# EAGLE design ESP12_Jig (EAGLE 9.6.2)
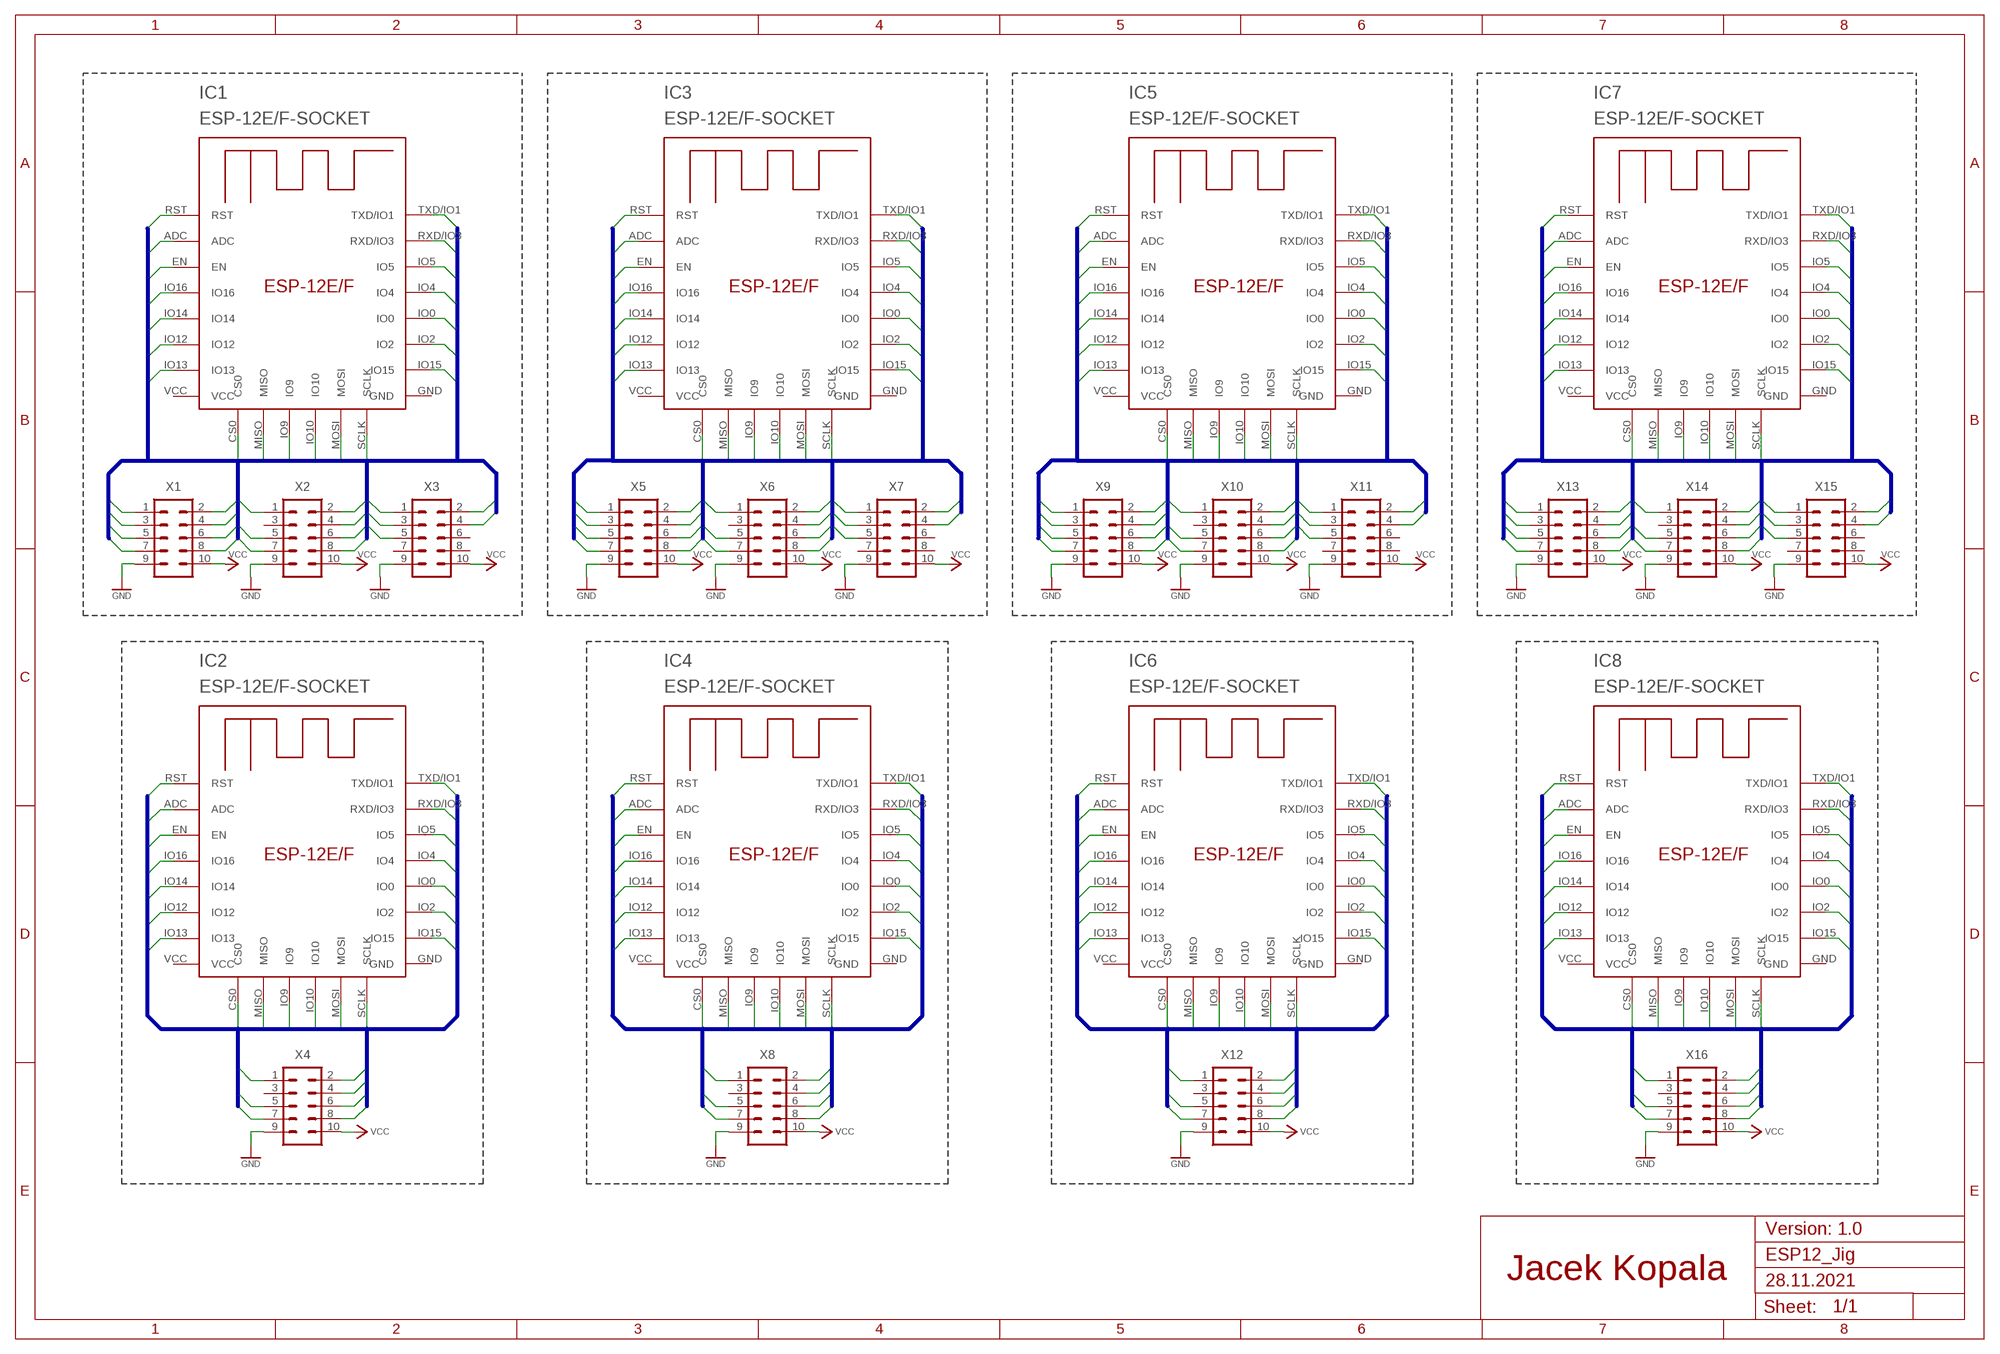
[diagram p0: schematic, sheet 1]

## Parts
IC1  ESP-12E/F-SOCKET  [ESP-12E/F-SOCKET]
IC2  ESP-12E/F-SOCKET  [ESP-12E/F-SOCKET]
IC3  ESP-12E/F-SOCKET  [ESP-12E/F-SOCKET]
IC4  ESP-12E/F-SOCKET  [ESP-12E/F-SOCKET]
IC5  ESP-12E/F-SOCKET  [ESP-12E/F-SOCKET]
IC6  ESP-12E/F-SOCKET  [ESP-12E/F-SOCKET]
IC7  ESP-12E/F-SOCKET  [ESP-12E/F-SOCKET]
IC8  ESP-12E/F-SOCKET  [ESP-12E/F-SOCKET]
X1  ML10  [ML10]
X2  ML10  [ML10]
X3  ML10  [ML10]
X4  ML10  [ML10]
X5  ML10  [ML10]
X6  ML10  [ML10]
X7  ML10  [ML10]
X8  ML10  [ML10]
X9  ML10  [ML10]
X10  ML10  [ML10]
X11  ML10  [ML10]
X12  ML10  [ML10]
X13  ML10  [ML10]
X14  ML10  [ML10]
X15  ML10  [ML10]
X16  ML10  [ML10]

## Nets
ADC_1: IC1.ADC X1.8
ADC_3: IC3.ADC X5.8
ADC_4: IC7.ADC X13.8
ADC_5: IC5.ADC X9.8
ADC_6: IC2.ADC
ADC_7: IC6.ADC
ADC_8: IC8.ADC
ADC_9: IC4.ADC
CS0_1: IC1.CS0 X1.2
CS0_3: IC3.CS0 X5.2
CS0_4: IC7.CS0 X13.2
CS0_5: IC5.CS0 X9.2
CS0_6: IC2.CS0
CS0_7: IC6.CS0
CS0_8: IC8.CS0
CS0_9: IC4.CS0
EN_1: IC1.EN X2.5
EN_3: IC3.EN X6.5
EN_4: IC7.EN X14.5
EN_5: IC5.EN X10.5
EN_6: IC2.EN X4.5
EN_7: IC6.EN X12.5
EN_8: IC8.EN X16.5
EN_9: IC4.EN X8.5
G0_1: IC1.IO0 X2.4
G0_3: IC3.IO0 X6.4
G0_4: IC7.IO0 X14.4
G0_5: IC5.IO0 X10.4
G0_6: IC2.IO0 X4.4
G0_7: IC6.IO0 X12.4
G0_8: IC8.IO0 X16.4
G0_9: IC4.IO0 X8.4
G2_1: IC1.IO2 X2.2
G2_3: IC3.IO2 X6.2
G2_4: IC7.IO2 X14.2
G2_5: IC5.IO2 X10.2
G2_6: IC2.IO2 X4.2
G2_7: IC6.IO2 X12.2
G2_8: IC8.IO2 X16.2
G2_9: IC4.IO2 X8.2
G4_1: IC1.IO4 X3.4
G4_3: IC3.IO4 X7.4
G4_4: IC7.IO4 X15.4
G4_5: IC5.IO4 X11.4
G4_6: IC2.IO4
G4_7: IC6.IO4
G4_8: IC8.IO4
G4_9: IC4.IO4
G5_1: IC1.IO5 X3.5
G5_3: IC3.IO5 X7.5
G5_4: IC7.IO5 X15.5
G5_5: IC5.IO5 X11.5
G5_6: IC2.IO5
G5_7: IC6.IO5
G5_8: IC8.IO5
G5_9: IC4.IO5
G9_1: IC1.IO9 X1.1
G9_3: IC3.IO9 X5.1
G9_4: IC7.IO9 X13.1
G9_5: IC5.IO9 X9.1
G9_6: IC2.IO9
G9_7: IC6.IO9
G9_8: IC8.IO9
G9_9: IC4.IO9
G10_1: IC1.IO10 X3.2
G10_3: IC3.IO10 X7.2
G10_4: IC7.IO10 X15.2
G10_5: IC5.IO10 X11.2
G10_6: IC2.IO10
G10_7: IC6.IO10
G10_8: IC8.IO10
G10_9: IC4.IO10
G12_1: IC1.IO12 X1.5
G12_3: IC3.IO12 X5.5
G12_4: IC7.IO12 X13.5
G12_5: IC5.IO12 X9.5
G12_6: IC2.IO12
G12_7: IC6.IO12
G12_8: IC8.IO12
G12_9: IC4.IO12
G13_1: IC1.IO13 X1.4
G13_3: IC3.IO13 X5.4
G13_4: IC7.IO13 X13.4
G13_5: IC5.IO13 X9.4
G13_6: IC2.IO13
G13_7: IC6.IO13
G13_8: IC8.IO13
G13_9: IC4.IO13
G14_1: IC1.IO14 X1.6
G14_3: IC3.IO14 X5.6
G14_4: IC7.IO14 X13.6
G14_5: IC5.IO14 X9.6
G14_6: IC2.IO14
G14_7: IC6.IO14
G14_8: IC8.IO14
G14_9: IC4.IO14
G15_1: IC1.IO15 X2.1
G15_3: IC3.IO15 X6.1
G15_4: IC7.IO15 X14.1
G15_5: IC5.IO15 X10.1
G15_6: IC2.IO15 X4.1
G15_7: IC6.IO15 X12.1
G15_8: IC8.IO15 X16.1
G15_9: IC4.IO15 X8.1
G16_1: IC1.IO16 X1.7
G16_3: IC3.IO16 X5.7
G16_4: IC7.IO16 X13.7
G16_5: IC5.IO16 X9.7
G16_6: IC2.IO16
G16_7: IC6.IO16
G16_8: IC8.IO16
G16_9: IC4.IO16
GND: X1.9 X2.9 X3.9 X4.9 X5.9 X6.9 X7.9 X8.9 X9.9 X10.9 X11.9 X12.9 X13.9 X14.9 X15.9 X16.9
MISO_1: IC1.MISO X1.3
MISO_3: IC3.MISO X5.3
MISO_4: IC7.MISO X13.3
MISO_5: IC5.MISO X9.3
MISO_6: IC2.MISO
MISO_7: IC6.MISO
MISO_8: IC8.MISO
MISO_9: IC4.MISO
MOSI_1: IC1.MOSI X3.3
MOSI_3: IC3.MOSI X7.3
MOSI_4: IC7.MOSI X15.3
MOSI_5: IC5.MOSI X11.3
MOSI_6: IC2.MOSI
MOSI_7: IC6.MOSI
MOSI_8: IC8.MOSI
MOSI_9: IC4.MOSI
RST_1: IC1.RST X2.7
RST_3: IC3.RST X6.7
RST_4: IC7.RST X14.7
RST_5: IC5.RST X10.7
RST_6: IC2.RST X4.7
RST_7: IC6.RST X12.7
RST_8: IC8.RST X16.7
RST_9: IC4.RST X8.7
RXD_1: IC1.RXD/IO3 X2.6
RXD_3: IC3.RXD/IO3 X6.6
RXD_4: IC7.RXD/IO3 X14.6
RXD_5: IC5.RXD/IO3 X10.6
RXD_6: IC2.RXD/IO3 X4.6
RXD_7: IC6.RXD/IO3 X12.6
RXD_8: IC8.RXD/IO3 X16.6
RXD_9: IC4.RXD/IO3 X8.6
SCLK_1: IC1.SCLK X3.1
SCLK_3: IC3.SCLK X7.1
SCLK_4: IC7.SCLK X15.1
SCLK_5: IC5.SCLK X11.1
SCLK_6: IC2.SCLK
SCLK_7: IC6.SCLK
SCLK_8: IC8.SCLK
SCLK_9: IC4.SCLK
TXD_1: IC1.TXD/IO1 X2.8
TXD_3: IC3.TXD/IO1 X6.8
TXD_4: IC7.TXD/IO1 X14.8
TXD_5: IC5.TXD/IO1 X10.8
TXD_6: IC2.TXD/IO1 X4.8
TXD_7: IC6.TXD/IO1 X12.8
TXD_8: IC8.TXD/IO1 X16.8
TXD_9: IC4.TXD/IO1 X8.8
VCC: X1.10 X2.10 X3.10 X4.10 X5.10 X6.10 X7.10 X8.10 X9.10 X10.10 X11.10 X12.10 X13.10 X14.10 X15.10 X16.10
Unconnected: X2.3 X3.6 X3.7 X3.8 X4.3 X6.3 X7.6 X7.7 X7.8 X8.3 X10.3 X11.6 X11.7 X11.8 X12.3 X14.3 X15.6 X15.7 X15.8 X16.3

## Buses
ADC_1,ADC_3,CS0_1,CS0_3,EN_1,EN_3,G0_1,G0_3,G2_1,G2_3,G4_1,G4_3,G5_1,G5_3,G9_1,G9_3,G10_1,G10_3,G12_1,G12_3,G13_1,G13_3,G14_1,G14_3,G15_1,G15_3,G16_1,G16_3,MISO_1,MISO_3,MOSI_1,MOSI_3,RST_1,RST_3,RXD_1,RXD_3,SCLK_1,SCLK_3,TXD_1,TXD_3
ADC_4,CS0_4,EN_4,G0_4,G2_4,G4_4,G5_4,G9_4,G10_4,G12_4,G13_4,G14_4,G15_4,G16_4,MISO_4,MOSI_4,RST_4,RXD_4,SCLK_4,TXD_4
ADC_5,CS0_5,EN_5,G0_5,G2_5,G4_5,G5_5,G9_5,G10_5,G12_5,G13_5,G14_5,G15_5,G16_5,MISO_5,MOSI_5,RST_5,RXD_5,SCLK_5,TXD_5
ADC_6,CS0_6,EN_6,G0_6,G2_6,G4_6,G5_6,G9_6,G10_6,G12_6,G13_6,G14_6,G15_6,G16_6,MISO_6,MOSI_6,RST_6,RXD_6,SCLK_6,TXD_6
ADC_7,CS0_7,EN_7,G0_7,G2_7,G4_7,G5_7,G9_7,G10_7,G12_7,G13_7,G14_7,G15_7,G16_7,MISO_7,MOSI_7,RST_7,RXD_7,SCLK_7,TXD_7
ADC_8,CS0_8,EN_8,G0_8,G2_8,G4_8,G5_8,G9_8,G10_8,G12_8,G13_8,G14_8,G15_8,G16_8,MISO_8,MOSI_8,RST_8,RXD_8,SCLK_8,TXD_8
ADC_9,CS0_9,EN_9,G0_9,G2_9,G4_9,G5_9,G9_9,G10_9,G12_9,G13_9,G14_9,G15_9,G16_9,MISO_9,MOSI_9,RST_9,RXD_9,SCLK_9,TXD_9

## Notes on the sheet
- Version: 1.0
- Jacek Kopala
- 28.11.2021

## Power pins joined to a net without a drawn wire
GND: IC1.GND IC2.GND IC3.GND IC4.GND IC5.GND IC6.GND IC7.GND IC8.GND
VCC: IC1.VCC IC2.VCC IC3.VCC IC4.VCC IC5.VCC IC6.VCC IC7.VCC IC8.VCC

## Library data of the parts
IC1-IC8 = esp-12e-f:ESP-12E/F-SOCKET
X1-X16 = con-harting-ml:ML10: HARTING; OC_FARNELL: unknown; OC_NEWARK: unknown

## Board
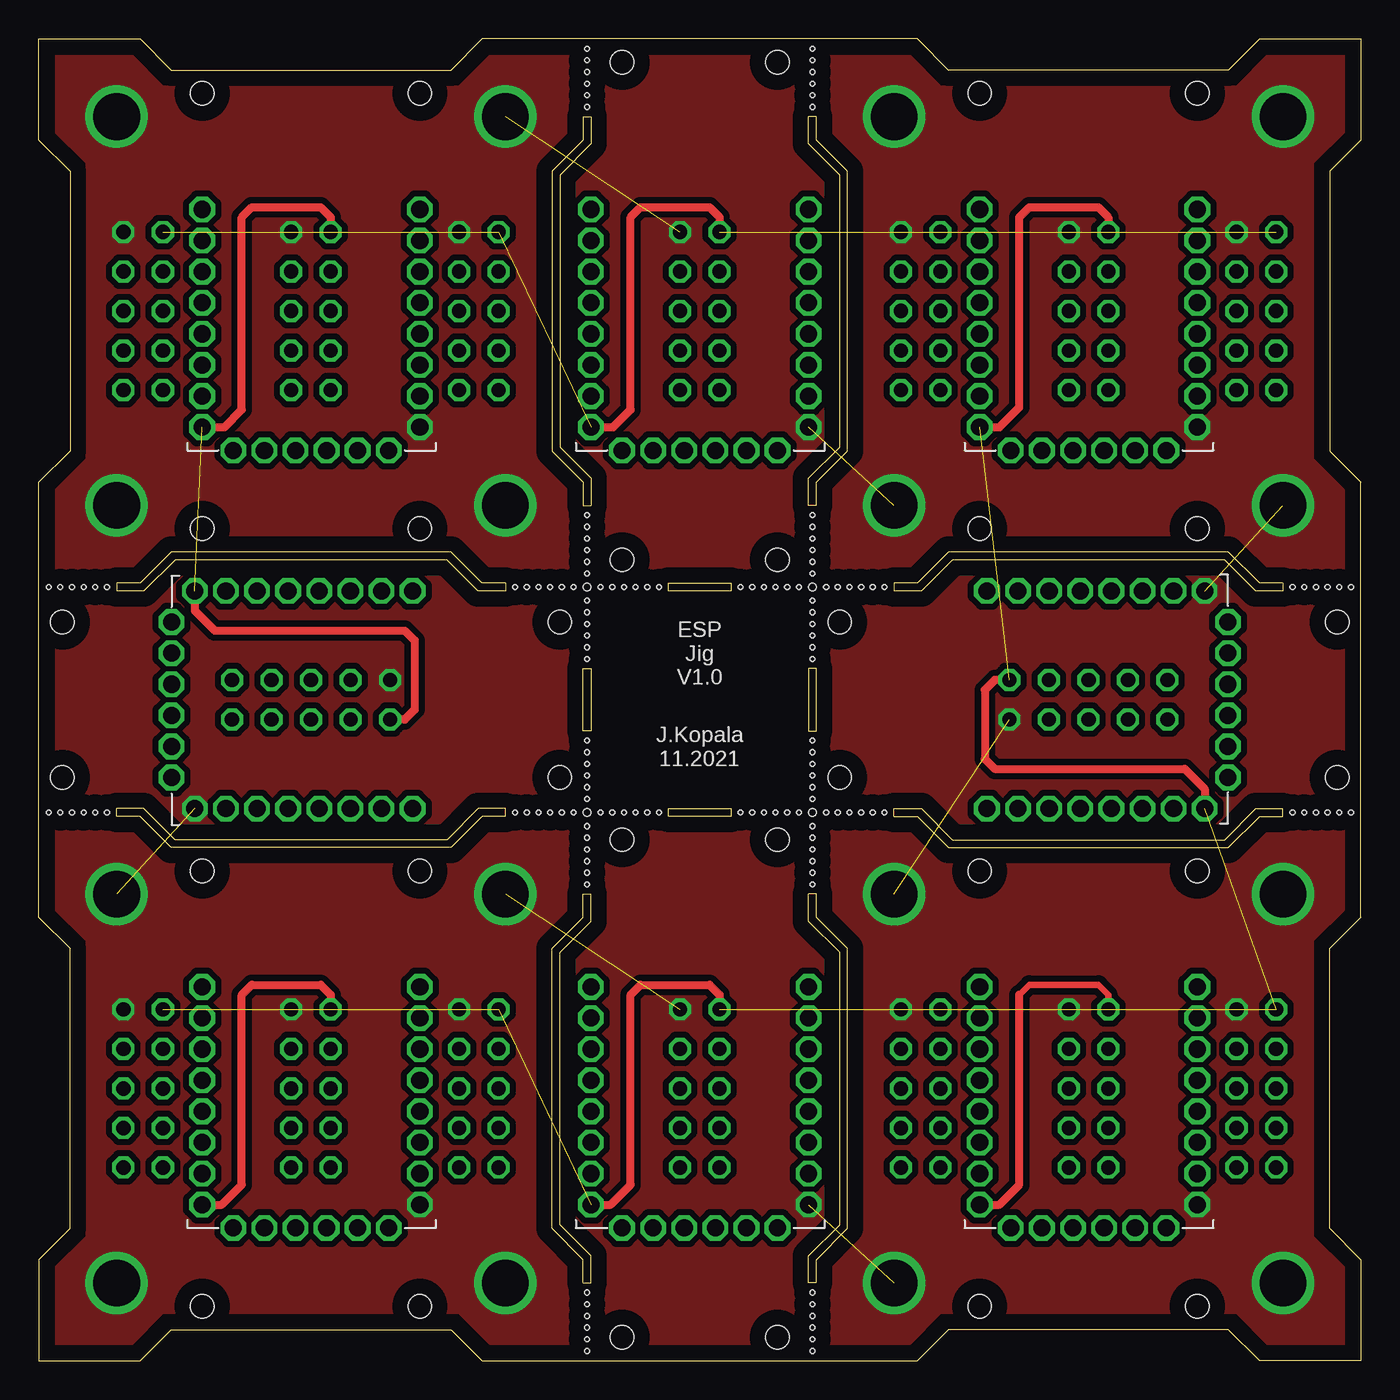
[diagram p1: board, top side]
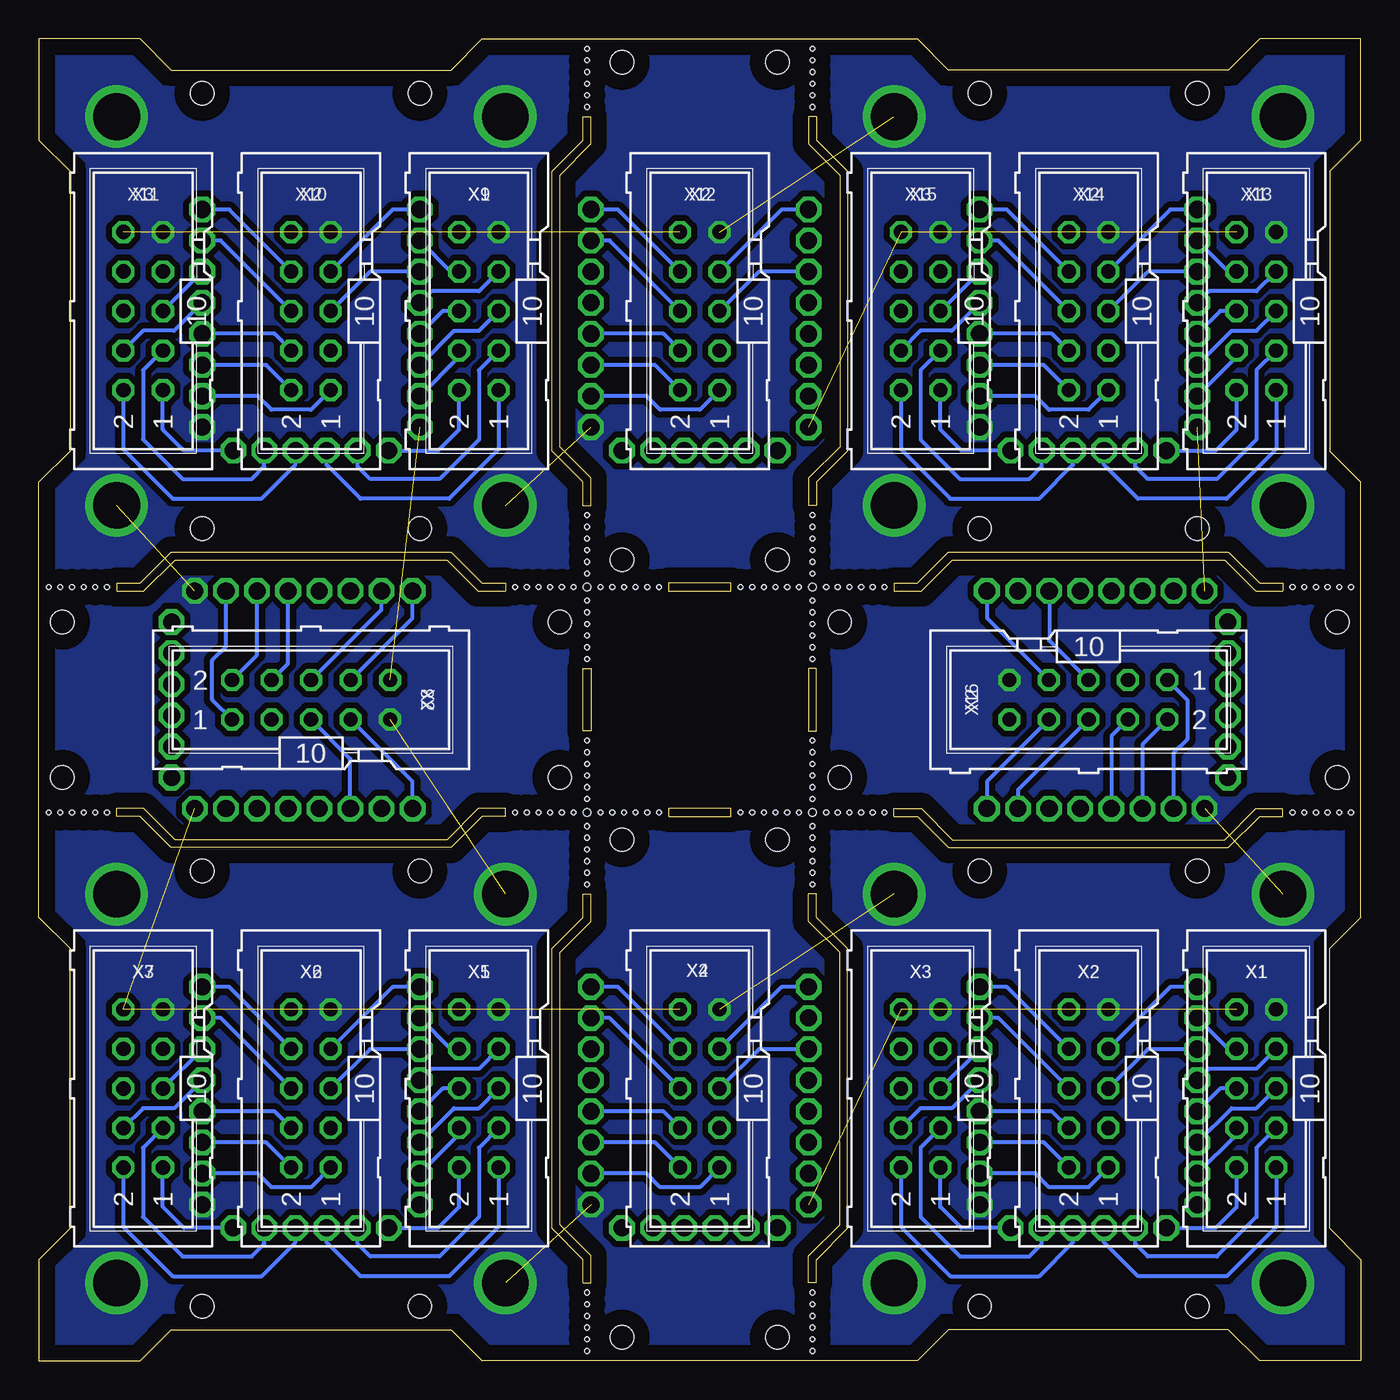
[diagram p2: board, bottom side, seen from below]

Size 85 x 85 mm. Coordinates in mm from the lower left corner, seen from the top.
Outline: 83,9.5 83,25.5
Outline: 75.5,2 59.5,2
Outline: 2,75.5 2,59.5
Outline: 9.5,83 25.5,83
Outline: 75.5,83 59.5,83
Outline: 83,75.5 83,59.5
Outline: 0,0 6.5,0 8.5,2 26.5,2 28.5,0 56.5,0 58.5,2 76.5,2 78.5,0 85,0 85,6.5 83,8.5 83,26.5 85,28.5 85,56.5 83,58.5 83,76.5 85,78.5 85,85 78.5,85 76.5,83 58.5,83 56.5,85 28.5,85 26.5,83 8.5,83 6.5,85 0,85 0,78.5 2,76.5 2,58.5 0,56.5 0,28.5 2,26.5 2,8.5 0,6.5 0,0
Outline: 35.5,5 35.5,6.75 33.5,8.75 33.5,26.25 35.5,28.25 35.5,30 35,30 35,28.5 33,26.5 33,8.5 35,6.5 35,5 35.5,5
Outline: 30,35.5 28.25,35.5 26.25,33.5 8.75,33.5 6.75,35.5 5,35.5 5,35 6.5,35 8.5,33 26.5,33 28.5,35 30,35 30,35.5
Outline: 49.5,5 49.5,6.75 51.5,8.75 51.5,26.25 49.5,28.25 49.5,30 50,30 50,28.5 52,26.5 52,8.5 50,6.5 50,5 49.5,5
Outline: 55,35.5 56.75,35.5 58.75,33.5 76.25,33.5 78.25,35.5 80,35.5 80,35 78.5,35 76.5,33 58.5,33 56.5,35 55,35 55,35.5
Outline: 35.5,80 35.5,78.25 33.5,76.25 33.5,58.75 35.5,56.75 35.5,55 35,55 35,56.5 33,58.5 33,76.5 35,78.5 35,80 35.5,80
Outline: 30,49.5 28.25,49.5 26.25,51.5 8.75,51.5 6.75,49.5 5,49.5 5,50 6.5,50 8.5,52 26.5,52 28.5,50 30,50 30,49.5
Outline: 80,49.5 78.25,49.5 76.25,51.5 58.75,51.5 56.75,49.5 55,49.5 55,50 56.5,50 58.5,52 76.5,52 78.5,50 80,50 80,49.5
Outline: 49.5,55 49.5,56.75 51.5,58.75 51.5,76.25 49.5,78.25 49.5,80 50,80 50,78.5 52,76.5 52,58.5 50,56.5 50,55 49.5,55
Outline: 35.5,40.5 35,40.5 35,44.5 35.5,44.5 35.5,40.5
Outline: 49.5,40.5 50,40.5 50,44.5 49.5,44.5 49.5,40.5
Outline: 40.5,49.5 40.5,50 44.5,50 44.5,49.5 40.5,49.5
Outline: 44.5,35.5 44.5,35 40.5,35 40.5,35.5 44.5,35.5
Copper layers (1*16): Top 0.035mm / dielectric 1.5mm / Bottom 0.035mm
Design rules "default": minimum track width 6mil, minimum drill 0.35mm, track to track 6mil, track to pad 6mil, pad to pad 6mil, via to via 6mil, smd to smd 6mil, copper to edge 40mil, drill to drill 6mil, minimum pad ring 10mil, minimum via ring 8mil, stop-mask expansion 4mil, vias tented up to drill 0mil, thermal gap 10mil
Holes 0.5 mm at 35.25,35.25 49.75,35.25 35.25,49.75 49.75,49.75
Holes 0.3 mm at 35.25,54.38 35.25,53.62 35.25,52.88 35.25,52.12 35.25,51.38 35.25,50.62 49.75,50.62 49.75,51.38 49.75,52.12 49.75,52.88 49.75,53.62 49.75,54.38 49.75,30.62 49.75,31.38 49.75,32.12 49.75,32.88 49.75,33.62 49.75,34.38 35.25,34.38 35.25,33.62 35.25,32.88 35.25,32.12 35.25,31.38 35.25,30.62 50.62,49.75 51.38,49.75 52.12,49.75 52.88,49.75 53.62,49.75 54.38,49.75 30.62,49.75 31.38,49.75 32.12,49.75 32.88,49.75 33.62,49.75 34.38,49.75 30.62,35.25 31.38,35.25 32.12,35.25 32.88,35.25 33.62,35.25 34.38,35.25 50.62,35.25 51.38,35.25 52.12,35.25 52.88,35.25 53.62,35.25 54.38,35.25 0.62,49.75 1.38,49.75 2.12,49.75 2.88,49.75 3.62,49.75 4.38,49.75 0.62,35.25 1.38,35.25 2.12,35.25 2.88,35.25 3.62,35.25 4.38,35.25 35.25,0.62 35.25,1.38 35.25,2.12 35.25,2.88 35.25,3.62 35.25,4.38 49.75,4.38 49.75,3.62 49.75,2.88 49.75,2.12 49.75,1.38 49.75,0.62 80.62,35.25 81.38,35.25 82.12,35.25 82.88,35.25 83.62,35.25 84.38,35.25 80.62,49.75 81.38,49.75 82.12,49.75 82.88,49.75 83.62,49.75 84.38,49.75 49.75,80.62 49.75,81.38 49.75,82.12 49.75,82.88 49.75,83.62 49.75,84.38 35.25,80.62 35.25,81.38 35.25,82.12 35.25,82.88 35.25,83.62 35.25,84.38 39.88,49.75 39.12,49.75 38.38,49.75 37.62,49.75 36.88,49.75 36.12,49.75 48.88,49.75 48.12,49.75 47.38,49.75 46.62,49.75 45.88,49.75 45.12,49.75 35.25,45.12 35.25,45.88 35.25,46.62 35.25,47.38 35.25,48.12 35.25,48.88 35.25,36.12 35.25,36.88 35.25,37.62 35.25,38.38 35.25,39.12 35.25,39.88 48.88,35.25 48.12,35.25 47.38,35.25 46.62,35.25 45.88,35.25 45.12,35.25 49.75,36.12 49.75,36.88 49.75,37.62 49.75,38.38 49.75,39.12 49.75,39.88 49.75,45.12 49.75,45.88 49.75,46.62 49.75,47.38 49.75,48.12 49.75,48.88 36.12,35.25 36.88,35.25 37.62,35.25 38.38,35.25 39.12,35.25 39.88,35.25
Holes 1.5 mm at 10.5,53.5 24.5,53.5 24.5,81.5 10.5,81.5 60.5,53.5 74.5,53.5 74.5,81.5 60.5,81.5 10.5,3.5 24.5,3.5 10.5,31.5 24.5,31.5 60.5,3.5 74.5,3.5 60.5,31.5 74.5,31.5 1.5,47.5 1.5,37.5 33.5,47.5 33.5,37.5 37.5,51.5 47.5,51.5 51.5,47.5 51.5,37.5 37.5,33.5 47.5,33.5 37.5,83.5 47.5,83.5 37.5,1.5 47.5,1.5 83.5,37.5 83.5,47.5

### Footprints (pad centres in the part's own frame; a part is rotated, then mirrored left to right if it is on the bottom)
ESP-12E/F-SOCKET = drill 1.1 octagon: ADC -7,5.53; CS0 -5,-7.97; EN -7,3.53; GND 7,-6.47; IO0 7,-0.47; IO2 7,-2.47; IO4 7,1.53; IO5 7,3.53; IO9 -1,-7.97; IO10 1,-7.97; IO12 -7,-2.47; IO13 -7,-4.47; IO14 -7,-0.47; IO15 7,-4.47; IO16 -7,1.53; MISO -3,-7.97; MOSI 3,-7.97; RST -7,7.53; RXD/IO3 7,5.53; SCLK 5,-7.97; TXD/IO1 7,7.53; VCC -7,-6.47
ML10 = drill 0.914 octagon: 1 -5.08,-1.27; 2 -5.08,1.27; 3 -2.54,-1.27; 4 -2.54,1.27; 5 0,-1.27; 6 0,1.27; 7 2.54,-1.27; 8 2.54,1.27; 9 5.08,-1.27; 10 5.08,1.27

### Placement (x,y rotation side)
IC1  17.5,16.5 0 top
IC2  42.5,16.5 0 top
IC3  67.5,16.5 0 top
IC4  68.5,42.5 90 top
IC5  67.5,66.5 0 top
IC6  42.5,66.5 0 top
IC7  17.5,66.5 0 top
IC8  16.5,42.5 270 top
X1  6.7,17.5 90 bottom
X2  17.5,17.5 90 bottom
X3  28.3,17.5 90 bottom
X4  42.5,17.5 90 bottom
X5  56.7,17.5 90 bottom
X6  67.5,17.5 90 bottom
X7  78.3,17.5 90 bottom
X8  67.5,42.5 0 bottom
X9  56.7,67.5 90 bottom
X10  67.5,67.5 90 bottom
X11  78.3,67.5 90 bottom
X12  42.5,67.5 90 bottom
X13  6.7,67.5 90 bottom
X14  17.5,67.5 90 bottom
X15  28.3,67.5 90 bottom
X16  17.5,42.5 180 bottom

### Tracks (layer width: path | path; a pad name or v marks a point on that pad's centre or on a via)
ADC_1
  Bottom 0.254: IC1.ADC 8.51,20.04 X1.8
ADC_3
  Bottom 0.254: IC3.ADC 58.51,20.04 X5.8
ADC_4
  Bottom 0.254: IC7.ADC 8.51,70.04 X13.8
ADC_5
  Bottom 0.254: IC5.ADC 58.51,70.04 X9.8
CS0_1
  Bottom 0.254: IC1.CS0 9.33,8.53 7.98,9.88 X1.2
CS0_3
  Bottom 0.254: IC3.CS0 59.33,8.53 57.98,9.88 X5.2
CS0_4
  Bottom 0.254: IC7.CS0 9.33,58.53 7.98,59.88 X13.2
CS0_5
  Bottom 0.254: IC5.CS0 59.33,58.53 57.98,59.88 X9.2
EN_1
  Bottom 0.254: IC1.EN 13.7,20.03 X2.5
EN_3
  Bottom 0.254: IC3.EN 63.7,20.03 X6.5
EN_4
  Bottom 0.254: IC7.EN 13.7,70.03 X14.5
EN_5
  Bottom 0.254: IC5.EN 63.7,70.03 X10.5
EN_6
  Bottom 0.254: IC2.EN 38.7,20.03 X4.5
EN_7
  Bottom 0.254: IC6.EN 38.7,70.03 X12.5
EN_8
  Bottom 0.254: IC8.EN 20.03,46.3 X16.5
EN_9
  Bottom 0.254: IC4.EN 64.97,38.7 X8.5
G0_1
  Bottom 0.254: X2.4 19.84,16.03 IC1.IO0
G0_3
  Bottom 0.254: X6.4 69.84,16.03 IC3.IO0
G0_4
  Bottom 0.254: X14.4 19.84,66.03 IC7.IO0
G0_5
  Bottom 0.254: X10.4 69.84,66.03 IC5.IO0
G0_6
  Bottom 0.254: X4.4 44.84,16.03 IC2.IO0
G0_7
  Bottom 0.254: X12.4 44.84,66.03 IC6.IO0
G0_8
  Bottom 0.254: X16.4 16.03,40.16 IC8.IO0
G0_9
  Bottom 0.254: X8.4 68.97,44.84 IC4.IO0
G2_1
  Bottom 0.254: X2.2 20.38,14.03 IC1.IO2
G2_3
  Bottom 0.254: X6.2 70.38,14.03 IC3.IO2
G2_4
  Bottom 0.254: X14.2 20.38,64.03 IC7.IO2
G2_5
  Bottom 0.254: X10.2 70.38,64.03 IC5.IO2
G2_6
  Bottom 0.254: X4.2 45.38,14.03 IC2.IO2
G2_7
  Bottom 0.254: X12.2 45.38,64.03 IC6.IO2
G2_8
  Bottom 0.254: X16.2 14.03,39.62 IC8.IO2
G2_9
  Bottom 0.254: X8.2 70.97,45.38 IC4.IO2
G4_1
  Bottom 0.254: IC1.IO4 26.3,16.23 28.3,16.23 X3.4
G4_3
  Bottom 0.254: IC3.IO4 76.3,16.23 78.3,16.23 X7.4
G4_4
  Bottom 0.254: IC7.IO4 26.3,66.23 28.3,66.23 X15.4
G4_5
  Bottom 0.254: IC5.IO4 76.3,66.23 78.3,66.23 X11.4
G5_1
  Bottom 0.254: IC1.IO5 X3.5
G5_3
  Bottom 0.254: IC3.IO5 X7.5
G5_4
  Bottom 0.254: IC7.IO5 X15.5
G5_5
  Bottom 0.254: IC5.IO5 X11.5
G9_1
  Bottom 0.254: X1.1 5.44,8.61 8.61,5.44 14.32,5.44 16.5,7.61 IC1.IO9
G9_3
  Bottom 0.254: X5.1 55.44,8.61 58.61,5.44 64.33,5.44 66.5,7.61 IC3.IO9
G9_4
  Bottom 0.254: X13.1 5.44,58.61 8.61,55.44 14.32,55.44 16.5,57.61 IC7.IO9
G9_5
  Bottom 0.254: X9.1 55.44,58.61 58.61,55.44 64.33,55.44 66.5,57.61 IC5.IO9
G10_1
  Bottom 0.254: X3.2 29.56,8.61 26.39,5.44 20.68,5.44 18.5,7.61 IC1.IO10
G10_3
  Bottom 0.254: X7.2 79.56,8.61 76.39,5.44 70.67,5.44 68.5,7.61 IC3.IO10
G10_4
  Bottom 0.254: X15.2 29.56,58.61 26.39,55.44 20.68,55.44 18.5,57.61 IC7.IO10
G10_5
  Bottom 0.254: X11.2 79.56,58.61 76.39,55.44 70.67,55.44 68.5,57.61 IC5.IO10
G12_1
  Bottom 0.254: IC1.IO12 8.3,16.23 6.7,16.23 X1.5
G12_3
  Bottom 0.254: IC3.IO12 58.3,16.23 56.7,16.23 X5.5
G12_4
  Bottom 0.254: IC7.IO12 8.3,66.23 6.7,66.23 X13.5
G12_5
  Bottom 0.254: IC5.IO12 58.3,66.23 56.7,66.23 X9.5
G13_1
  Bottom 0.254: IC1.IO13 7.98,14.55 X1.4
G13_3
  Bottom 0.254: IC3.IO13 57.98,14.55 X5.4
G13_4
  Bottom 0.254: IC7.IO13 7.98,64.56 X13.4
G13_5
  Bottom 0.254: IC5.IO13 57.98,64.56 X9.4
G14_1
  Bottom 0.254: X1.6 9.03,17.5 IC1.IO14
G14_3
  Bottom 0.254: X5.6 59.03,17.5 IC3.IO14
G14_4
  Bottom 0.254: X13.6 9.03,67.5 IC7.IO14
G14_5
  Bottom 0.254: X9.6 59.03,67.5 IC5.IO14
G15_1
  Bottom 0.254: X2.1 17.5,11.15 20.04,11.15 20.92,12.03 IC1.IO15
G15_3
  Bottom 0.254: X6.1 67.5,11.15 70.04,11.15 70.92,12.03 IC3.IO15
G15_4
  Bottom 0.254: X14.1 17.5,61.15 20.04,61.15 20.92,62.03 IC7.IO15
G15_5
  Bottom 0.254: X10.1 67.5,61.15 70.04,61.15 70.92,62.03 IC5.IO15
G15_6
  Bottom 0.254: X4.1 42.5,11.15 45.04,11.15 45.92,12.03 IC2.IO15
G15_7
  Bottom 0.254: X12.1 42.5,61.15 45.04,61.15 45.92,62.03 IC6.IO15
G15_8
  Bottom 0.254: X16.1 11.15,42.5 11.15,39.96 12.03,39.08 IC8.IO15
G15_9
  Bottom 0.254: X8.1 73.85,42.5 73.85,45.04 72.97,45.92 IC4.IO15
G16_1
  Bottom 0.254: X1.7 6.7,18.77 9.76,18.77 IC1.IO16
G16_3
  Bottom 0.254: X5.7 56.7,18.77 59.76,18.77 IC3.IO16
G16_4
  Bottom 0.254: X13.7 6.7,68.77 9.76,68.77 IC7.IO16
G16_5
  Bottom 0.254: X9.7 56.7,68.77 59.76,68.77 IC5.IO16
GND  (via drill 3)  (7 unrouted)
  other vias: 5,5 5,80 5,30 30,30 55,30 80,30 5,55 30,55 55,55 80,55 30,80 55,80 30,5 80,5 80,80 55,5
  pour Bottom (isolate 0.406, no thermals): 1,84 6,84 8,82 27,82 29,84 56,84 58,82 77,82 79,84 84,84 84,79 82,77 82,58 84,56 84,29 82,27 82,8 84,6 84,1 79,1 77,3 58,3 56,1 29,1 27,3 8,3 6,1 1,1 1,6 3,8 3,27 1,29 1,56 3,58 3,77 1,79
  pour Top (isolate 0.406, no thermals): 1,84 6,84 8,82 27,82 29,84 56,84 58,82 77,82 79,84 84,84 84,79 82,77 82,58 84,56 84,29 82,27 82,8 84,6 84,1 79,1 77,3 58,3 56,1 29,1 27,3 8,3 6,1 1,1 1,6 3,8 3,27 1,29 1,56 3,58 3,77 1,79
MISO_1
  Bottom 0.254: X1.3 6.7,13.69 6.7,9.24 9.24,6.7 13.7,6.7 14.5,7.51 IC1.MISO
MISO_3
  Bottom 0.254: X5.3 56.7,13.69 56.7,9.24 59.25,6.7 63.7,6.7 64.5,7.51 IC3.MISO
MISO_4
  Bottom 0.254: X13.3 6.7,63.69 6.7,59.25 9.24,56.7 13.7,56.7 14.5,57.51 IC7.MISO
MISO_5
  Bottom 0.254: X9.3 56.7,63.69 56.7,59.25 59.25,56.7 63.7,56.7 64.5,57.51 IC5.MISO
MOSI_1
  Bottom 0.254: X3.3 28.3,13.69 28.3,9.24 25.75,6.7 21.31,6.7 20.5,7.52 IC1.MOSI
MOSI_3
  Bottom 0.254: X7.3 78.3,13.69 78.3,9.24 75.75,6.7 71.31,6.7 70.5,7.52 IC3.MOSI
MOSI_4
  Bottom 0.254: X15.3 28.3,63.69 28.3,59.25 25.75,56.7 21.31,56.7 20.5,57.52 IC7.MOSI
MOSI_5
  Bottom 0.254: X11.3 78.3,63.69 78.3,59.25 75.75,56.7 71.31,56.7 70.5,57.52 IC5.MOSI
RST_1
  Bottom 0.254: IC1.RST 12.24,24.03 X2.7
RST_3
  Bottom 0.254: IC3.RST 62.24,24.03 X6.7
RST_4
  Bottom 0.254: IC7.RST 12.24,74.03 X14.7
RST_5
  Bottom 0.254: IC5.RST 62.24,74.03 X10.7
RST_6
  Bottom 0.254: IC2.RST 37.24,24.03 X4.7
RST_7
  Bottom 0.254: IC6.RST 37.24,74.03 X12.7
RST_8
  Bottom 0.254: IC8.RST 24.03,47.76 X16.7
RST_9
  Bottom 0.254: IC4.RST 60.97,37.24 X8.7
RXD_1
  Bottom 0.254: X2.6 23.3,22.03 IC1.RXD/IO3
RXD_3
  Bottom 0.254: X6.6 73.3,22.03 IC3.RXD/IO3
RXD_4
  Bottom 0.254: X14.6 23.3,72.03 IC7.RXD/IO3
RXD_5
  Bottom 0.254: X10.6 73.3,72.03 IC5.RXD/IO3
RXD_6
  Bottom 0.254: X4.6 48.3,22.03 IC2.RXD/IO3
RXD_7
  Bottom 0.254: X12.6 48.3,72.03 IC6.RXD/IO3
RXD_8
  Bottom 0.254: X16.6 22.03,36.7 IC8.RXD/IO3
RXD_9
  Bottom 0.254: X8.6 62.97,48.3 IC4.RXD/IO3
SCLK_1
  Bottom 0.254: X3.1 27.02,9.88 25.68,8.53 IC1.SCLK
SCLK_3
  Bottom 0.254: X7.1 77.03,9.88 75.67,8.53 IC3.SCLK
SCLK_4
  Bottom 0.254: X15.1 27.02,59.88 25.68,58.53 IC7.SCLK
SCLK_5
  Bottom 0.254: X11.1 77.03,59.88 75.67,58.53 IC5.SCLK
TXD_1
  Bottom 0.254: X2.8 22.76,24.03 IC1.TXD/IO1
TXD_3
  Bottom 0.254: X6.8 72.76,24.03 IC3.TXD/IO1
TXD_4
  Bottom 0.254: X14.8 22.76,74.03 IC7.TXD/IO1
TXD_5
  Bottom 0.254: X10.8 72.76,74.03 IC5.TXD/IO1
TXD_6
  Bottom 0.254: X4.8 47.76,24.03 IC2.TXD/IO1
TXD_7
  Bottom 0.254: X12.8 47.76,74.03 IC6.TXD/IO1
TXD_8
  Bottom 0.254: X16.8 24.03,37.24 IC8.TXD/IO1
TXD_9
  Bottom 0.254: X8.8 60.97,47.76 IC4.TXD/IO1
VCC  (15 unrouted)
  Top 0.406: 63.05,23.53 63.69,24.17 68.14,24.17 68.77,23.53 X6.10
  Top 0.508: IC1.VCC 11.77,10.03 13.05,11.32 13.05,23.53 13.69,24.17 18.14,24.17 18.77,23.53 X2.10 | IC2.VCC 36.77,10.03 38.05,11.32 38.05,23.53 38.69,24.17 43.13,24.17 43.77,23.53 X4.10 | IC3.VCC 61.77,10.03 63.05,11.32 63.05,23.53 | IC7.VCC 11.93,60.03 13.05,61.15 13.05,73.53 13.69,74.17 18.14,74.17 18.77,73.53 X14.10 | IC6.VCC 36.94,60.03 38.05,61.15 38.05,73.53 38.69,74.17 43.13,74.17 43.77,73.53 X12.10 | IC5.VCC 61.77,60.03 63.05,61.31 63.05,73.53 63.69,74.17 68.14,74.17 68.77,73.53 X10.10 | IC8.VCC 10.03,48.23 11.32,46.95 23.53,46.95 24.17,46.31 24.17,41.87 23.53,41.23 X16.10 | X8.10 61.47,43.77 60.83,43.13 60.83,38.69 61.47,38.05 73.69,38.05 74.97,36.77 IC4.VCC

### Text on the board
tPlace: ESP / Jig / V1.0 | J.Kopala / 11.2021
_bNames: X1 | X2 | X3 | X2 | X1 | X2 | X3 | X2 | X2 | X1 | X2 | X3 | X2 | X1 | X2 | X3